# Altium schematic sheet 4_电子天平_ADC.SchDoc: 电子天平_ADC
size A4; Date: 2020/01/07; ApprovedBy: Riggin; CheckedBy: Riggin; Author: Riggin; DrawnBy: Riggin; Engineer: Riggin; DocumentNumber: 5; Revision: V1.0; SheetNumber: 5; SheetTotal: 8; Time: 14:09:34; ProjectName: 电子天平
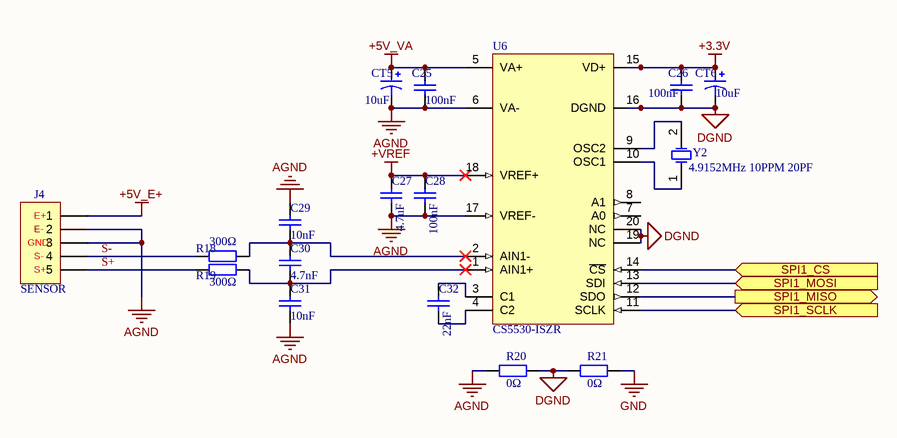
[diagram p0: 4_电子天平_ADC.SchDoc]

## Parts
C25  100nF  [LC-0805_C]
C26  100nF  [LC-0805_C]
C27  4.7uF  [LC-0805_C]
C28  100nF  [LC-0805_C]
C29  10nF  [LC-0805_C]
C30  4.7nF  [LC-0805_C]
C31  10nF  [LC-0805_C]
C32  22nF  [LC-0805_C]
CT5  10uF  [LC-CASE-A_3216]
CT6  10uF  [LC-CASE-A_3216]
J4  SENSOR
R18  300Ω  [LC-0805_R]
R19  300Ω  [LC-0805_R]
R20  0Ω  [LC-0402_R]
R21  0Ω  [LC-0402_R]
U6  CS5530-ISZR  [LC-SSOP-20_208mil]
Y2  value 4.9152MHz 10PPM 20PF  [LC-HC-49SMD]  (hidden comment: 49MD-4.9152-20-10-10/B)

## Ports
SPI1_CS (in), SPI1_MISO (out), SPI1_MOSI (in), SPI1_SCLK (in)

## Nets
+3.3V: C26.1 CT6.1 U6.15(VD+)
+5V_E+: J4.1
+5V_VA: C25.1 CT5.1 U6.5(VA+)
+VREF: C27.1 C28.1 U6.18(VREF+)
AGND: C25.2 C27.2 C28.2 C29.2 C31.1 CT5.2 J4.2 J4.3 R20.2 U6.6(VA-) U6.17(VREF-)
DGND: C26.2 CT6.2 R20.1 R21.2 U6.16(DGND) U6.19(NC) U6.20(NC)
GND: R21.1
S+: J4.5 R19.2
S-: J4.4 R18.2
SPI1_CS: U6.14(~{CS}) ; port SPI1_CS
SPI1_MISO: U6.12(SDO) ; port SPI1_MISO
SPI1_MOSI: U6.13(SDI) ; port SPI1_MOSI
SPI1_SCLK: U6.11(SCLK) ; port SPI1_SCLK
NetC29_1: C29.1 C30.2 R18.1 U6.2(AIN1-)
NetC30_1: C30.1 C31.2 R19.1 U6.1(AIN1+)
NetC32_1: C32.1 U6.4(C2)
NetC32_2: C32.2 U6.3(C1)
NetU6_9: U6.9(OSC2) Y2.2(OSC2)
NetU6_10: U6.10(OSC1) Y2.1(OSC1)

Not connected (* = marked no-connect by the designer): U6 7(A0) 8(A1)

## Notes on the sheet
- (near J4) E+
- (near J4) GND
- (near J4) E-
- (near J4) S-
- (near J4) S+
- Title
- Company:
- Address:
- 广东省广州市
- DZT Studio
- Size:
- Date:
- Drawn By:
- A4
- Riggin
- Time:
- Revision:
- Approved By:
- Sheet
- of
- Email:
- RigginLi@icloud.com
- Project:

## Library data of the parts
C25-C32 = Cap: MLCC; Value: 100pF; Published: 8-Jun-2000; LatestRevisionDate: 17-Jul-2002; LatestRevisionNote: Re-released for DXP Platform.; PackageReference: RAD-0.3; Publisher: Altium Limited; PackageDescription: Radial Cap, Thru-Hole; 2 Leads; 0.3 in Pin Spacing
CT5 CT6 = Cap Pol1: 钽电容; Published: 8-Jun-2000; LatestRevisionDate: 17-Jul-2002; LatestRevisionNote: Re-released for DXP Platform.; PackageReference: RB7.6-15; Publisher: Altium Limited; Value: 10uF
J4 = Header 5: Header, 5-Pin; LatestRevisionDate: 17-Jul-2002; LatestRevisionNote: Re-released for DXP Platform.; Publisher: Altium Limited
R18-R21 = Res2: Resistor; Value: 1K; Published: 8-Jun-2000; LatestRevisionDate: 17-Jul-2002; LatestRevisionNote: Re-released for DXP Platform.; PackageReference: AXIAL-0.4; Publisher: Altium Limited; PackageDescription: Axial Device, Thru-Hole; 2 Leads; 0.4 in Pin Spacing
U6 = CS5530: 24bits模数转换芯片
Y2 = SMD-5032_2P 11.0592MHZ 20PF 20PPM: 贴片无源晶振; ComponentLink1Description: 供应商链接; ComponentLink1URL: http://www.szlcsc.com/product/details_53039.html; Package: SMD-5032_2P; Supplier: LC; SuppliersPartNumber: C52026